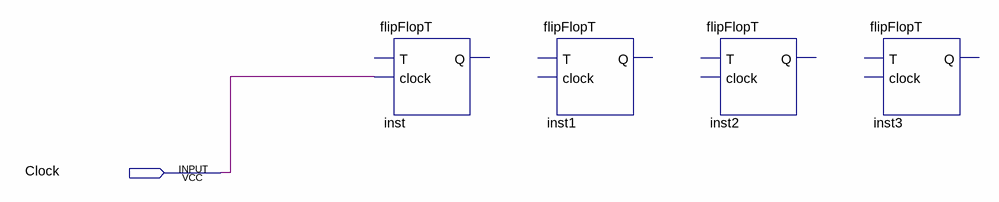
[diagram p0: schematic sheet]
// Quartus schematic contadorSync.bdf as structural Verilog: 4 symbols, 1 pins
module contadorSync (
  input  Clock
);

  flipFlopT inst (.clock(Clock));  // open: T, Q
  flipFlopT inst1 ();  // open: T, clock, Q
  flipFlopT inst2 ();  // open: T, clock, Q
  flipFlopT inst3 ();  // open: T, clock, Q
endmodule
